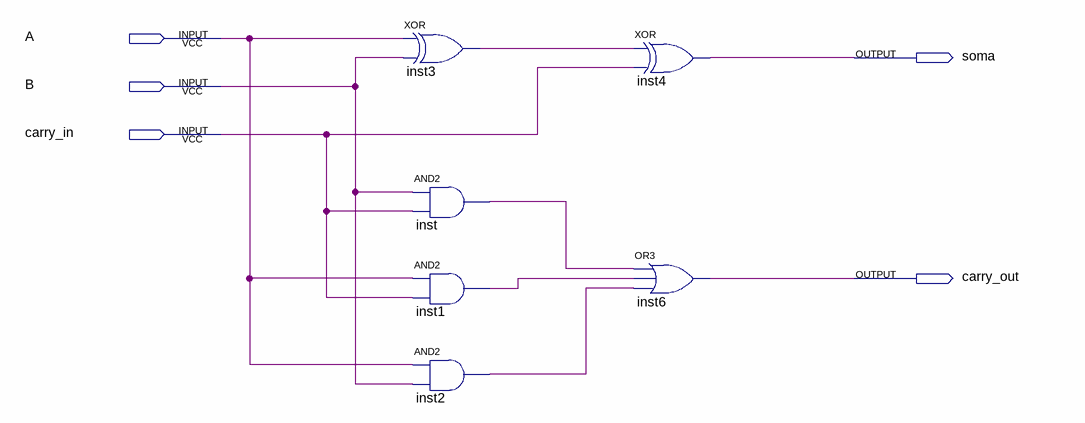
[diagram p0: schematic sheet]
// Quartus schematic somador_completo.bdf as structural Verilog: 6 symbols, 5 pins
module somador_completo (
  input  A,
  input  B,
  input  carry_in,
  output soma,
  output carry_out
);

  wire inst1_out, inst2_out, inst3_out, inst_out;

  xor inst3 (inst3_out, A, B);
  and inst (inst_out, B, carry_in);
  and inst1 (inst1_out, A, carry_in);
  and inst2 (inst2_out, A, B);
  xor inst4 (soma, inst3_out, carry_in);
  or inst6 (carry_out, inst_out, inst1_out, inst2_out);
endmodule
